# Altium schematic sheet DM1097_HUB.SchDoc: =project_title (part 1 of 2)
size Tabloid; PageSetup: Record=PageOptions|CenterHorizontal=True|CenterVertical=True|PrintScale=0.73|XCorrection=1.00|YCorrection=1.00|PrintKind=0|BorderSize=5000000|LeftOffset=0|BottomOffset=0|Orientation=2|PaperLength=1000|PaperWidth=1000|Scale=100|PaperSource=7|PrintQuality=-4|MediaType=1|DitherType=10|PaperKind=A4|PrintScaleMode=1; CompanyName: Luxonis Holding; Organization: Luxonis Holding; Address1: 1925 Harmony Park Drive; Address2: Westminster, CO; Address3: 80234; Address4: United States; SheetNumber: 8; SheetTotal: 17
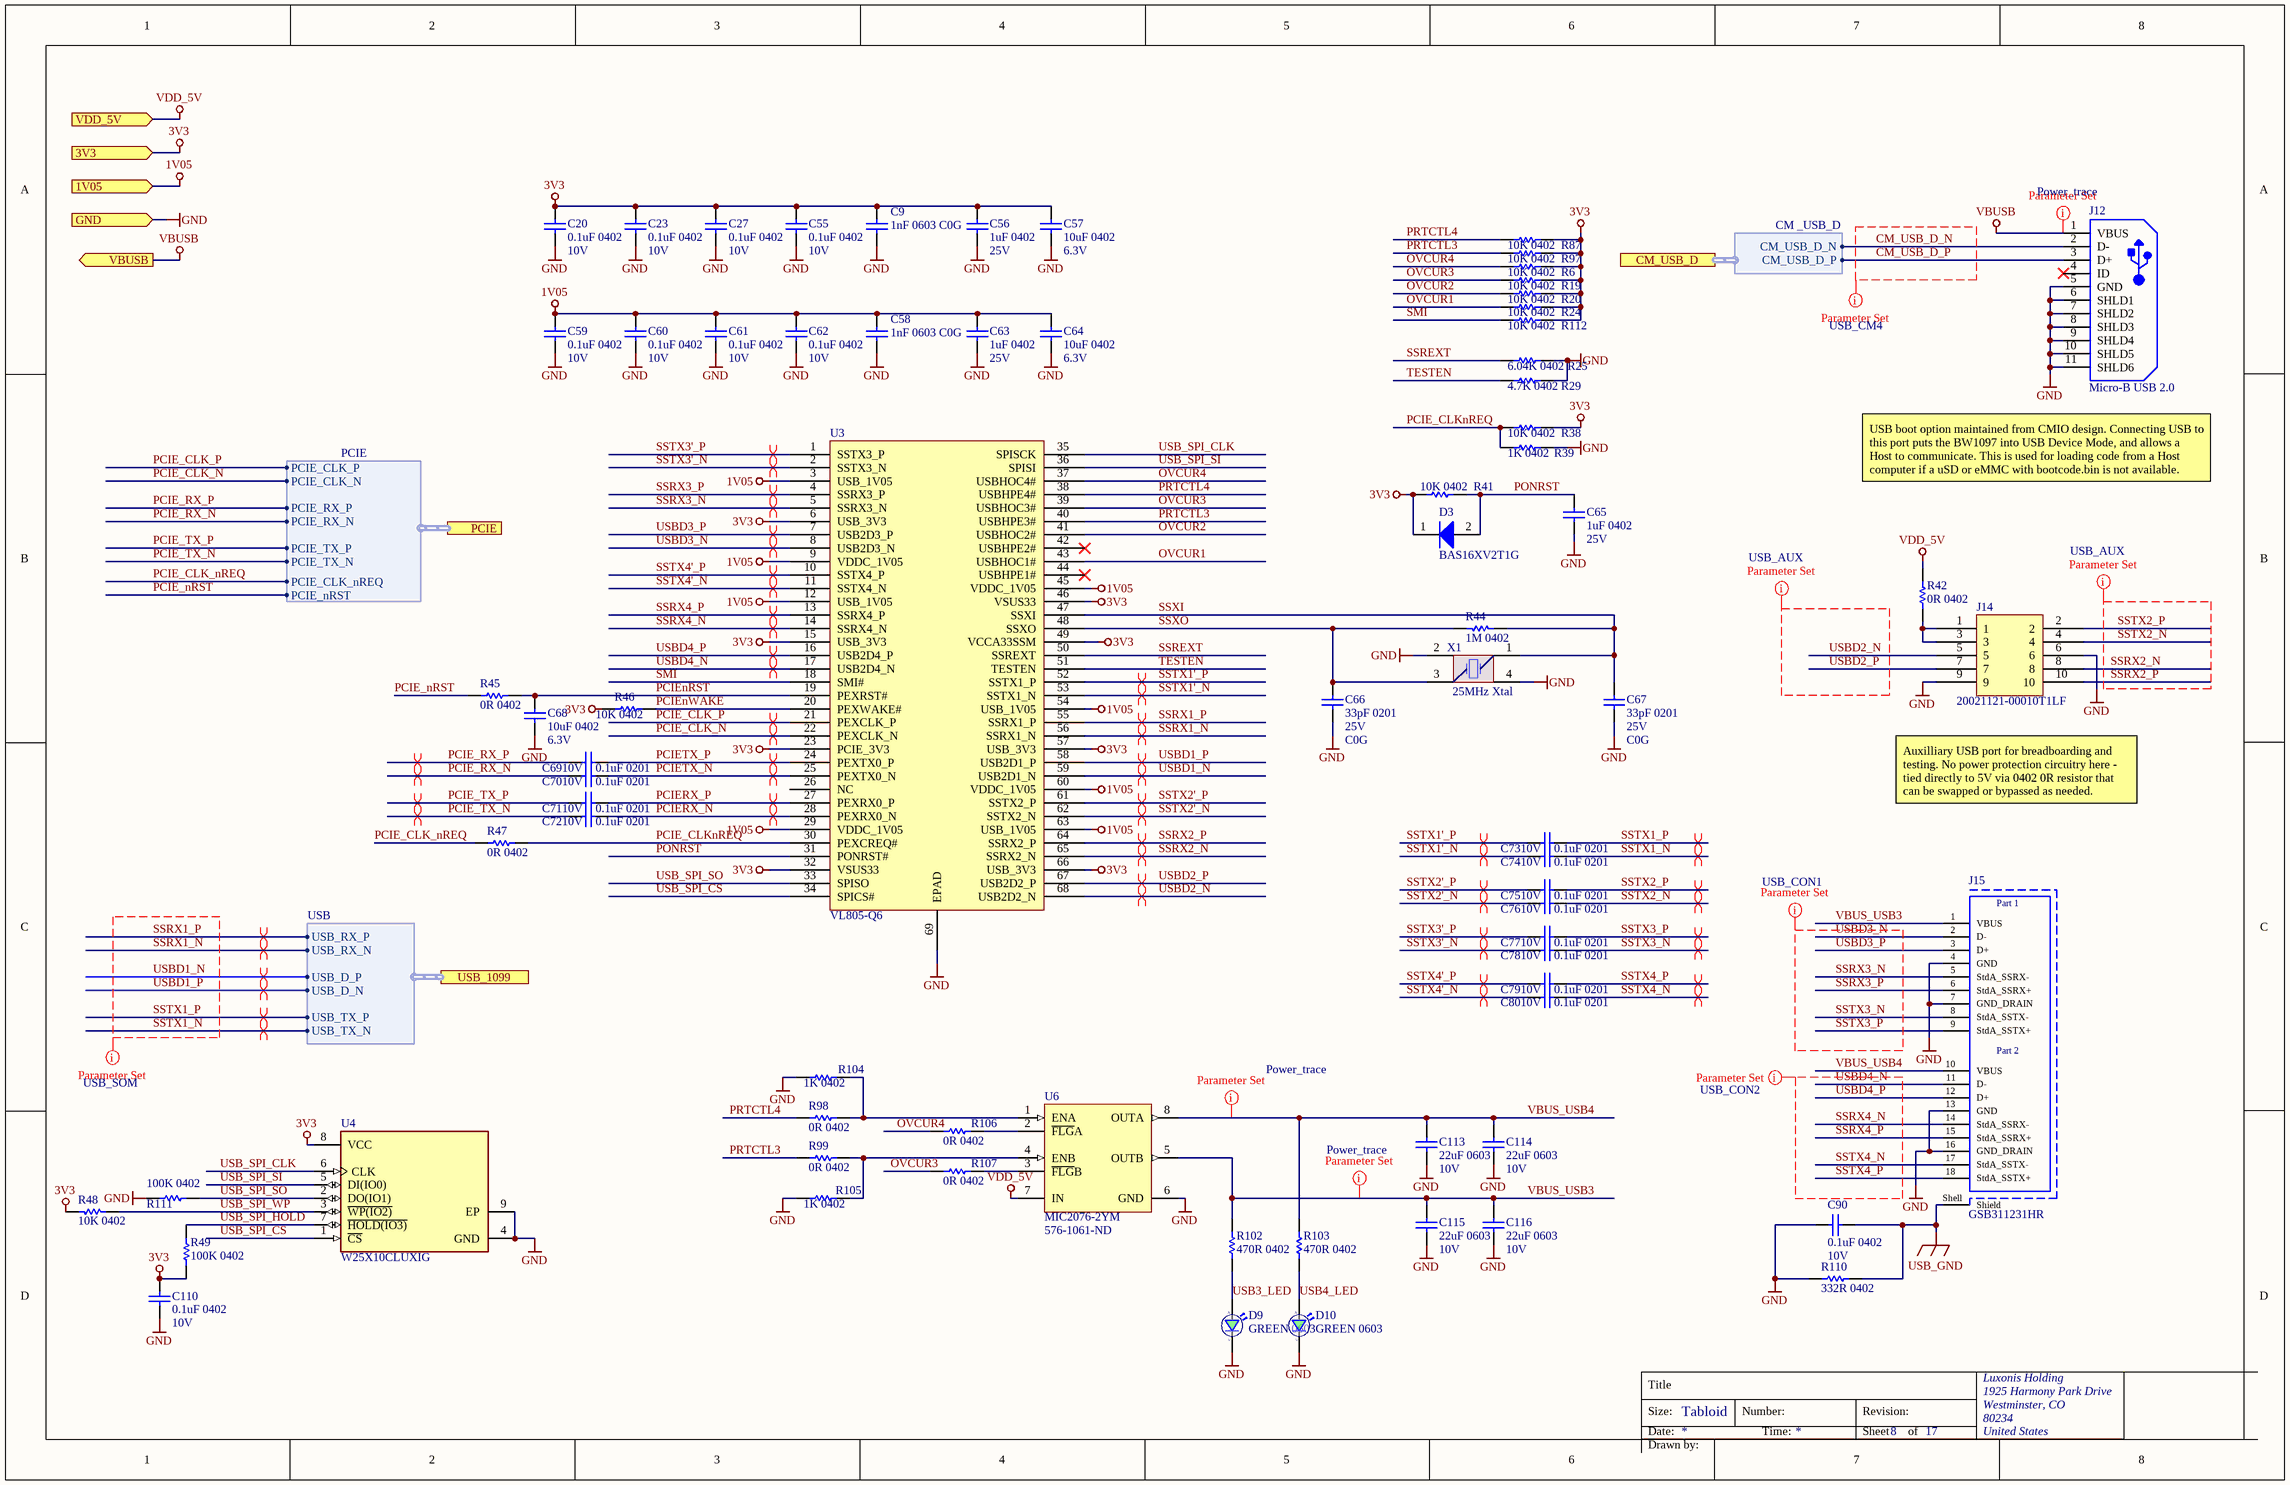
[diagram p0: DM1097_HUB.SchDoc]

## Parts
C9  1nF 0603 C0G  [CAPC0603(1608)100_N]
C20  0.1uF 0402  Voltage Rating: 10V  [CAPC0402(1005)70_N]
C23  0.1uF 0402  Voltage Rating: 10V  [CAPC0402(1005)70_N]
C27  0.1uF 0402  Voltage Rating: 10V  [CAPC0402(1005)70_N]
C55  0.1uF 0402  Voltage Rating: 10V  [CAPC0402(1005)70_N]
C56  1uF 0402  Voltage Rating: 25V  [CAPC0402(1005)70_N]
C57  10uF 0402  Voltage Rating: 6.3V  [CAPC0402(1005)70_N]
C58  1nF 0603 C0G  [CAPC0603(1608)100_N]
C59  0.1uF 0402  Voltage Rating: 10V  [CAPC0402(1005)70_N]
C60  0.1uF 0402  Voltage Rating: 10V  [CAPC0402(1005)70_N]
C61  0.1uF 0402  Voltage Rating: 10V  [CAPC0402(1005)70_N]
C62  0.1uF 0402  Voltage Rating: 10V  [CAPC0402(1005)70_N]
C63  1uF 0402  Voltage Rating: 25V  [CAPC0402(1005)70_N]
C64  10uF 0402  Voltage Rating: 6.3V  [CAPC0402(1005)70_N]
C65  1uF 0402  Voltage Rating: 25V  [CAPC0402(1005)70_N]
C66  33pF 0201  Voltage Rating: 25V  Dielectric: C0G  [CAPC0201(0603)33_L]
C67  33pF 0201  Voltage Rating: 25V  Dielectric: C0G  [CAPC0201(0603)33_L]
C68  10uF 0402  Voltage Rating: 6.3V  [CAPC0402(1005)70_N]
C69  0.1uF 0201  Voltage: 10V  [CAPC0201(0603)33_L]
C70  0.1uF 0201  Voltage: 10V  [CAPC0201(0603)33_L]
C71  0.1uF 0201  Voltage: 10V  [CAPC0201(0603)33_L]
C72  0.1uF 0201  Voltage: 10V  [CAPC0201(0603)33_L]
C73  0.1uF 0201  Voltage: 10V  [CAPC0201(0603)33_L]
C74  0.1uF 0201  Voltage: 10V  [CAPC0201(0603)33_L]
C75  0.1uF 0201  Voltage: 10V  [CAPC0201(0603)33_L]
C76  0.1uF 0201  Voltage: 10V  [CAPC0201(0603)33_L]
C77  0.1uF 0201  Voltage: 10V  [CAPC0201(0603)33_L]
C78  0.1uF 0201  Voltage: 10V  [CAPC0201(0603)33_L]
C79  0.1uF 0201  Voltage: 10V  [CAPC0201(0603)33_L]
C80  0.1uF 0201  Voltage: 10V  [CAPC0201(0603)33_L]
C90  0.1uF 0402  Voltage Rating: 10V  [CAPC0402(1005)70_N]
C110  0.1uF 0402  Voltage Rating: 10V  [CAPC0402(1005)70_N]
C113  22uF 0603  Voltage Rating: 10V  [CAPC0603(1608)100_N]
C114  22uF 0603  Voltage Rating: 10V  [CAPC0603(1608)100_N]
C115  22uF 0603  Voltage Rating: 10V  [CAPC0603(1608)100_N]
C116  22uF 0603  Voltage Rating: 10V  [CAPC0603(1608)100_N]
D3  BAS16XV2T1G  [BAS16XV2T1G]
D9  GREEN 0603  [SML_D1xx8W]
D10  GREEN 0603  [SML_D1xx8W]
J12  Micro-B USB 2.0  [10118194-0001LF]
J14  20021121-00010T1LF  [20021121-00010T1LF]
J15  GSB311231HR  [GSB311231HR]
R6  10K 0402  [RESC0402(1005)_N]
R19  10K 0402  [RESC0402(1005)_N]
R20  10K 0402  [RESC0402(1005)_N]
R24  10K 0402  [RESC0402(1005)_N]
R25  6.04K 0402  [RESC0402(1005)_L]
R29  4.7K 0402  [RESC0402(1005)_N]
R38  10K 0402  [RESC0402(1005)_N]
R39  1K 0402  [RESC0402(1005)_L]
R41  10K 0402  [RESC0402(1005)_N]
R42  0R 0402  [RESC0402(1005)_N]
R44  1M 0402  [RESC0402(1005)_N]
R45  0R 0402  [RESC0402(1005)_N]
R46  10K 0402  [RESC0402(1005)_N]
R47  0R 0402  [RESC0402(1005)_N]
R48  10K 0402  [RESC0402(1005)_N]
R49  100K 0402  [RESC0402(1005)_L]
R87  10K 0402  [RESC0402(1005)_N]
R97  10K 0402  [RESC0402(1005)_N]
R98  0R 0402  [RESC0402(1005)_N]
R99  0R 0402  [RESC0402(1005)_N]
R102  470R 0402  [RESC0402(1005)_N]
R103  470R 0402  [RESC0402(1005)_N]
R104  1K 0402  [RESC0402(1005)_L]
R105  1K 0402  [RESC0402(1005)_L]
R106  0R 0402  [RESC0402(1005)_N]
R107  0R 0402  [RESC0402(1005)_N]
R110  332R 0402  [RESC0402(1005)_N]
R111  100K 0402  [RESC0402(1005)_L]
R112  10K 0402  [RESC0402(1005)_N]
U3  VL805-Q6  [VL805_QFN-68]
U4  W25X10CLUXIG  [FP-UX-IPC_A]
U6  MIC2076-2YM  Supplier Part Number 1: 576-1061-ND  [MIC2076-2YM]
X1  25MHz Xtal  [8Z-25.000MAAJ-T]

## Ports
1V05 (in), 3V3 (in), CM_USB_D (harness CM _USB_D), GND (in), PCIE (harness PCIE), USB_1099 (harness USB), VBUSB (out), VDD_5V (in)

## Harnesses
CM _USB_D: CM_USB_D_P, CM_USB_D_N
PCIE: PCIE_CLK_P, PCIE_CLK_N, PCIE_RX_P, PCIE_RX_N, PCIE_TX_N, PCIE_TX_P, PCIE_CLK_nREQ, PCIE_nRST
USB: USB_D_P, USB_D_N, USB_TX_N, USB_TX_P, USB_RX_N, USB_RX_P

## Nets
1V05: C58.2 C59.2 C60.2 C61.2 C62.2 C63.2 C64.2 U3.3(USB_1V05) U3.9(VDDC_1V05) U3.12(USB_1V05) U3.29(VDDC_1V05) U3.45(VDDC_1V05) U3.54(USB_1V05) U3.60(VDDC_1V05) U3.63(USB_1V05) ; port 1V05
3V3: C9.2 C20.2 C23.2 C27.2 C55.2 C56.2 C57.2 C110.2 D3.1(K) R6.2 R19.2 R20.2 R24.2 R38.2 R41.1 R46.1 R48.2 R49.2 R87.2 R97.2 R112.2 U3.6(USB_3V3) U3.15(USB_3V3) U3.23(PCIE_3V3) U3.32(VSUS33) U3.46(VSUS33) U3.49(VCCA33SSM) U3.57(USB_3V3) U3.66(USB_3V3) U4.8(VCC) ; port 3V3
GND: C9.1 C20.1 C23.1 C27.1 C55.1 C56.1 C57.1 C58.1 C59.1 C60.1 C61.1 C62.1 C63.1 C64.1 C65.1 C66.1 C67.1 C68.1 C90.1 C110.1 C113.2 C114.2 C115.2 C116.2 D9.1(C) D10.1(C) J12.5(GND) J12.6(SHLD1) J12.7(SHLD2) J12.8(SHLD3) J12.9(SHLD4) J12.10(SHLD5) J12.11(SHLD6) J14.6 J14.9 J15.4(GND) J15.7(GND_DRAIN) J15.13(GND) J15.16(GND_DRAIN) R25.2 R29.2 R39.2 R104.1 R105.1 R110.1 R111.1 U3.69(EPAD) U4.4(GND) U4.9(EP) U6.6(GND) X1.2 X1.4 ; port GND
USB_GND: C90.2 J15.Shell(Shield) R110.2
VBUSB: J12.1(VBUS) ; port VBUSB
VDD_5V: R42.2 U6.7(IN) ; port VDD_5V
CM_USB_D_N: J12.2(D-) ; port CM_USB_D.CM_USB_D_N
CM_USB_D_P: J12.3(D+) ; port CM_USB_D.CM_USB_D_P
OVCUR1: R24.1 U3.43(USBHOC1#)
OVCUR2: R20.1 U3.41(USBHOC2#)
OVCUR3: R19.1 R107.2 U3.39(USBHOC3#)
OVCUR4: R6.1 R106.2 U3.37(USBHOC4#)
PCIE_CLK_N: U3.22(PEXCLK_N) ; port PCIE.PCIE_CLK_N
PCIE_CLK_nREQ: R47.1 ; port PCIE.PCIE_CLK_nREQ
PCIE_CLK_P: U3.21(PEXCLK_P) ; port PCIE.PCIE_CLK_P
PCIE_CLKnREQ: R38.1 R39.1 R47.2 U3.30(PEXCREQ#)
PCIE_nRST: R45.1 ; port PCIE.PCIE_nRST
PCIE_RX_N: C70.1 ; port PCIE.PCIE_RX_N
PCIE_RX_P: C69.1 ; port PCIE.PCIE_RX_P
PCIE_TX_N: C72.1 ; port PCIE.PCIE_TX_N
PCIE_TX_P: C71.1 ; port PCIE.PCIE_TX_P
PCIEnRST: C68.2 R45.2 U3.19(PEXRST#)
PCIEnWAKE: R46.2 U3.20(PEXWAKE#)
PCIERX_N: C72.2 U3.28(PEXRX0_N)
PCIERX_P: C71.2 U3.27(PEXRX0_P)
PCIETX_N: C70.2 U3.25(PEXTX0_N)
PCIETX_P: C69.2 U3.24(PEXTX0_P)
PONRST: C65.2 D3.2(A) R41.2 U3.31(PONRST#)
PRTCTL3: R97.1 R99.2 U3.40(USBHPE3#)
PRTCTL4: R87.1 R98.2 U3.38(USBHPE4#)
SMI: R112.1 U3.18(SMI#)
SSREXT: R25.1 U3.50(SSREXT)
SSRX1_N: U3.56(SSRX1_N) ; port USB_1099.USB_RX_N
SSRX1_P: U3.55(SSRX1_P) ; port USB_1099.USB_RX_P
SSRX2_N: J14.8 U3.65(SSRX2_N)
SSRX2_P: J14.10 U3.64(SSRX2_P)
SSRX3_N: J15.5(StdA_SSRX-) U3.5(SSRX3_N)
SSRX3_P: J15.6(StdA_SSRX+) U3.4(SSRX3_P)
SSRX4_N: J15.14(StdA_SSRX-) U3.14(SSRX4_N)
SSRX4_P: J15.15(StdA_SSRX+) U3.13(SSRX4_P)
SSTX1'_N: C74.1 U3.53(SSTX1_N)
SSTX1'_P: C73.1 U3.52(SSTX1_P)
SSTX1_N: C74.2 ; port USB_1099.USB_TX_N
SSTX1_P: C73.2 ; port USB_1099.USB_TX_P
SSTX2'_N: C76.1 U3.62(SSTX2_N)
SSTX2'_P: C75.1 U3.61(SSTX2_P)
SSTX2_N: C76.2 J14.4
SSTX2_P: C75.2 J14.2
SSTX3'_N: C78.1 U3.2(SSTX3_N)
SSTX3'_P: C77.1 U3.1(SSTX3_P)
SSTX3_N: C78.2 J15.8(StdA_SSTX-)
SSTX3_P: C77.2 J15.9(StdA_SSTX+)
SSTX4'_N: C80.1 U3.11(SSTX4_N)
SSTX4'_P: C79.1 U3.10(SSTX4_P)
SSTX4_N: C80.2 J15.17(StdA_SSTX-)
SSTX4_P: C79.2 J15.18(StdA_SSTX+)
SSXI: C67.2 R44.1 U3.47(SSXI) X1.1(OSC1)
SSXO: C66.2 R44.2 U3.48(SSXO) X1.3(OSC3)
TESTEN: R29.1 U3.51(TESTEN)
USB3_LED: D9.2(A) R102.1
USB4_LED: D10.2(A) R103.1
USB_SPI_CLK: U3.35(SPISCK) U4.6(CLK)
USB_SPI_CS: U3.34(SPICS#) U4.1(~{CS})
USB_SPI_HOLD: R49.1 U4.7(~{HOLD(IO3)})
USB_SPI_SI: U3.36(SPISI) U4.5(DI(IO0))
USB_SPI_SO: R111.2 U3.33(SPISO) U4.2(DO(IO1))
USB_SPI_WP: R48.1 U4.3(~{WP(IO2)})
USBD1_N: U3.59(USB2D1_N) ; port USB_1099.USB_D_P
USBD1_P: U3.58(USB2D1_P) ; port USB_1099.USB_D_N
USBD2_N: J14.5 U3.68(USB2D2_N)
USBD2_P: J14.7 U3.67(USB2D2_P)
USBD3_N: J15.2(D-) U3.8(USB2D3_N)
USBD3_P: J15.3(D+) U3.7(USB2D3_P)
USBD4_N: J15.11(D-) U3.17(USB2D4_N)
USBD4_P: J15.12(D+) U3.16(USB2D4_P)
VBUS_USB3: C115.1 C116.1 J15.1(VBUS) R102.2 U6.5(OUTB)
VBUS_USB4: C113.1 C114.1 J15.10(VBUS) R103.2 U6.8(OUTA)
NetJ14_1: J14.1 J14.3 R42.1
NetR98_1: R98.1 R104.2 U6.1(ENA)
NetR99_1: R99.1 R105.2 U6.4(ENB)
NetR106_1: R106.1 U6.2(~{FLG}A)
NetR107_1: R107.1 U6.3(~{FLG}B)

Not connected (* = marked no-connect by the designer): J12 4(ID)*; U3 26(NC) 42(USBHPE2#)* 44(USBHPE1#)*

## Layout directives
net class Power_trace: VBUS_USB3, VBUS_USB4, VBUSB
differential pair; differential pair class 90ohm: SSRX1_N, SSRX1_P, SSRX2_N, SSRX2_P, SSRX3_N, SSRX3_P, SSRX4_N, SSRX4_P, SSTX1'_N, SSTX1'_P, SSTX1_N, SSTX1_P, SSTX2'_N, SSTX2'_P, SSTX2_N, SSTX2_P, SSTX3'_N, SSTX3'_P, SSTX3_N, SSTX3_P, SSTX4'_N, SSTX4'_P, SSTX4_N, SSTX4_P, USBD1_N, USBD1_P, USBD2_N, USBD2_P, USBD3_N, USBD3_P, USBD4_N, USBD4_P
differential pair; differential pair class 100ohm: PCIE_CLK_N, PCIE_CLK_P, PCIE_RX_N, PCIE_RX_P, PCIE_TX_N, PCIE_TX_P, PCIERX_N, PCIERX_P, PCIETX_N, PCIETX_P
net class USB_CON2: SSRX4_N, SSRX4_P, SSTX4_N, SSTX4_P, USBD4_N, USBD4_P
net class USB_CON1: SSRX3_N, SSRX3_P, SSTX3_N, SSTX3_P, USBD3_N, USBD3_P
net class USB_SOM: SSRX1_N, SSRX1_P, SSTX1_N, SSTX1_P, USBD1_N, USBD1_P
net class USB_AUX: SSRX2_N, SSRX2_P, SSTX2_N, SSTX2_P, USBD2_N, USBD2_P
net class USB_CM4: CM_USB_D_N, CM_USB_D_P

## Notes on the sheet
- (near J12) USB boot option maintained from CMIO design. Connecting USB to this port puts the BW1097 into USB Device Mode, and allows a Host to communicate. This is used for loading code from a Host computer if a uSD or eMMC with bootcode.bin is not available.
- Auxilliary USB port for breadboarding and testing. No power protection circuitry here - tied directly to 5V via 0402 0R resistor that can be swapped or bypassed as needed.
- Title
- Size:
- Date:
- Tabloid
- Number:
- Time:
- Revision:
- Sheet
- of
- Drawn by:
- (in symbol GSB311231HR) Part 1; Part 2